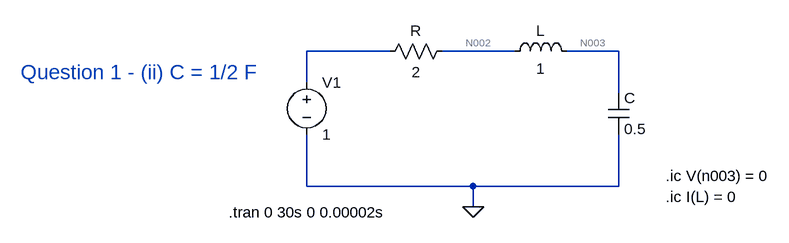
[diagram p0: schematic Q1(ii).asc]
Q1(ii).asc, the LTspice schematic file:
Version 4
SHEET 1 1360 680
WIRE 176 -208 48 -208
WIRE 368 -208 256 -208
WIRE 528 -208 448 -208
WIRE 48 -160 48 -208
WIRE 528 -144 528 -208
WIRE 48 0 48 -80
WIRE 304 0 48 0
WIRE 528 0 528 -80
WIRE 528 0 304 0
WIRE 304 32 304 0
FLAG 304 32 0
SYMBOL voltage 48 -176 R0
WINDOW 123 0 0 Left 0
WINDOW 39 0 0 Left 0
SYMATTR InstName V1
SYMATTR Value 1
SYMBOL res 272 -224 R90
WINDOW 0 0 56 VBottom 2
WINDOW 3 32 56 VTop 2
SYMATTR InstName R
SYMATTR Value 2
SYMBOL ind 464 -192 M270
WINDOW 0 32 56 VTop 2
WINDOW 3 5 56 VBottom 2
SYMATTR InstName L
SYMATTR Value 1
SYMBOL cap 512 -144 R0
SYMATTR InstName C
SYMATTR Value 0.5
TEXT -72 40 Left 2 !.tran 0 30s 0 0.00002s
TEXT 600 -16 Left 2 !.ic V(n003) = 0
TEXT 600 16 Left 2 !.ic I(L) = 0
TEXT -392 -176 Left 3 ;Question 1 - (ii) C = 1/2 F

The netlist it stands for:
* Q1(ii).asc
V1 N001 0 1
R N002 N001 2
L N003 N002 1
C N003 0 0.5
.tran 0 30s 0 0.00002s
.ic V(n003) = 0
.ic I(L) = 0
* Question 1 - (ii) C = 1/2 F
.backanno
.end

* Results of the author's LTspice run, read from the files saved beside the schematic
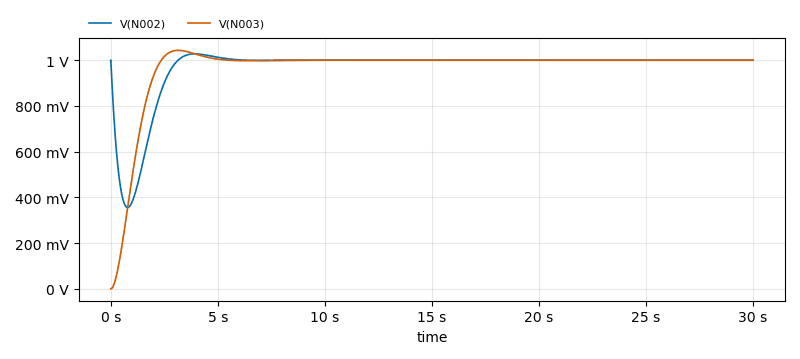
[diagram p1: Transient Analysis of Q1(ii).asc, plotted from the saved traces]
* Transient Analysis, 1 run:
*   V(N002): min 355.4 mV, max 1.028 V, average 966.7 mV, rms 974.7 mV, last 1 V
*   V(N003): min 0 V, max 1.043 V, average 966.6 mV, rms 978.9 mV, last 1 V